# EAGLE design regboard_2 (EAGLE 5.12)
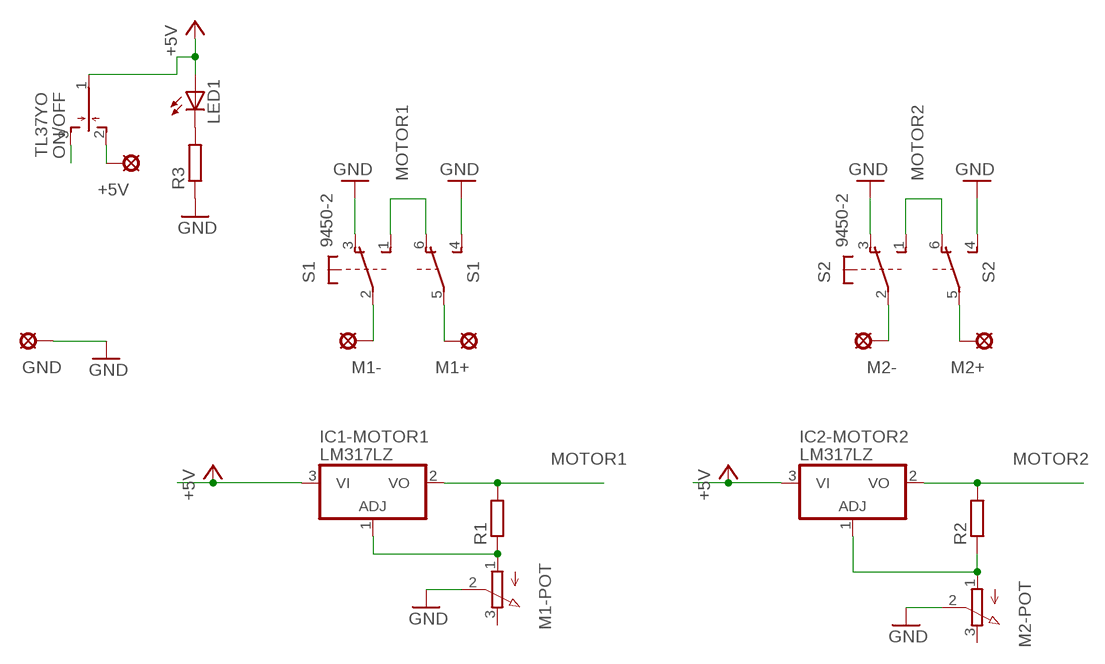
[diagram p0: schematic, sheet 1]

## Parts
+5V  SE11  [SE11]
GND  SE11  [SE11]
IC1-MOTOR1  LM317LZ  [TO92]
IC2-MOTOR2  LM317LZ  [TO92]
LED1  LED5MM  [LED5MM]
M1+  SE11  [SE11]
M1-  SE11  [SE11]
M1-POT  3RP/1610N  [3RP/1610N]
M2+  SE11  [SE11]
M2-  SE11  [SE11]
M2-POT  3RP/1610N  [3RP/1610N]
ON/OFF  TL37YO  [TL3XYO]
R1  R-EU_0207/12  [0207/12]
R2  R-EU_0207/12  [0207/12]
R3  R-EU_0207/12  [0207/12]
S1  9450-2  [9450-2]
S2  9450-2  [9450-2]

## Nets
+5V: IC1-MOTOR1.3(VI) IC2-MOTOR2.3(VI) LED1.A ON/OFF.1(C)
GND: GND.MP M1-POT.2(S) M2-POT.2(S) R3.1 S1.3(1:O) S1.4(2:S) S2.3(1:O) S2.4(2:S)
MOTOR1: IC1-MOTOR1.2(VO) R1.2 S1.1(1:S) S1.6(2:O)
MOTOR2: IC2-MOTOR2.2(VO) R2.2 S2.1(1:S) S2.6(2:O)
N$1: LED1.K(C) R3.2
N$4: ON/OFF.3(O2)
N$7: IC1-MOTOR1.1(ADJ) M1-POT.1(A) R1.1
N$8: IC2-MOTOR2.1(ADJ) M2-POT.1(A) R2.1
N$18: M2-.MP S2.2(1:P)
N$19: M2+.MP S2.5(2:P)
N$22: M1-.MP S1.2(1:P)
N$23: M1+.MP S1.5(2:P)
POWERIN: +5V.MP ON/OFF.2(O1)
Unconnected: M1-POT.3(E) M2-POT.3(E)

## Library data of the parts
+5V GND M1+ M1- M2+ M2- = solpad:SE11: SOLDER PAD RTM, drill 1,1mm, distributor Buerklin, 07F810
IC1-MOTOR1 IC2-MOTOR2 = matt:*317: Positive VOLTAGE REGULATOR
LED1 = matt led:LED: LED OSRAM: - CHIPLED LG R971, LG N971, LY N971, LG Q971, LY Q971, LO R971, LY R971 LH N974, LH R974 LS Q976, LO Q976, LY Q976 LO Q996 - Hyper CHIPLED LW Q18S LB Q993, LB Q99A, LB R99A - SideLED LS A670, LO A670, LY A670, LG A670, LP A670 LB A673, LV A673, LT A673, LW A673 LH A674 LY A675 LS A676, LA A676, LO A676, LY A676, LW A676 LS A679, LY A679, LG A679 - Hyper Micro SIDELED® LS Y876, LA Y876, LO Y876, LY Y876 LT Y87S - SmartLED LW L88C, LW L88S LB L89C, LB L89S, LG L890 LS L89K, LO L89K, LY L89K LS L896, LA L896, LO L896, LY L896 - TOPLED LS T670, LO T670, LY T670, LG T670, LP T670 LSG T670, LSP T670, LSY T670, LOP T670, LYG T670 LG T671, LOG T671, LSG T671 LB T673, LV T673, LT T673, LW T673 LH T674 LS T676, LA T676, LO T676, LY T676, LB T676, LH T676, LSB T676, LW T676 LB T67C, LV T67C, LT T67C, LS T67K, LO T67K, LY T67K, LW E67C LS E67B, LA E67B, LO E67B, LY E67B, LB E67C, LV E67C, LT E67C LW T67C LS T679, LY T679, LG T679 LS T770, LO T770, LY T770, LG T770, LP T770 LB T773, LV T773, LT T773, LW T773 LH T774 LS E675, LA E675, LY E675, LS T675 LS T776, LA T776, LO T776, LY T776, LB T776 LHGB T686 LT T68C, LB T68C - Hyper Mini TOPLED® LB M676 - Mini TOPLED Santana® LG M470 LS M47K, LO M47K, LY M47K Source: http://www.osram.convergy.de LUXEON: - LUMILED® LXK2-PW12-R00, LXK2-PW12-S00, LXK2-PW14-U00, LXK2-PW14-V00 LXK2-PM12-R00, LXK2-PM12-S00, LXK2-PM14-U00 LXK2-PE12-Q00, LXK2-PE12-R00, LXK2-PE12-S00, LXK2-PE14-T00, LXK2-PE14-U00 LXK2-PB12-K00, LXK2-PB12-L00, LXK2-PB12-M00, LXK2-PB14-N00, LXK2-PB14-P00, LXK2-PB14-Q00 LXK2-PR12-L00, LXK2-PR12-M00, LXK2-PR14-Q00, LXK2-PR14-R00 LXK2-PD12-Q00, LXK2-PD12-R00, LXK2-PD12-S00 LXK2-PH12-R00, LXK2-PH12-S00 LXK2-PL12-P00, LXK2-PL12-Q00, LXK2-PL12-R00 Source: www.luxeon.com KINGBRIGHT: KA-3528ASYC Source: www.kingbright.com
M1-POT M2-POT = pot:3RP/1610N: 16mm Potentiometer one level Source: http://www.alphapotentiometers.net/html/16mm_pot_2.html
ON/OFF = matt:TL37YO: TINY SWITCH MOM OFF MOM Source: http://www2.produktinfo.conrad.com/datenblaetter/700000-724999/705152-da-01-de-Subminiaturschalter_TL_36YO.pdf
R1-R3 = matt rcl:R-EU_: RESISTOR, European symbol
S1 S2 = switch-misc:9450-2: MARQUARDT SWITCH

## Net classes
0 default: width 0.4 mm

## Board
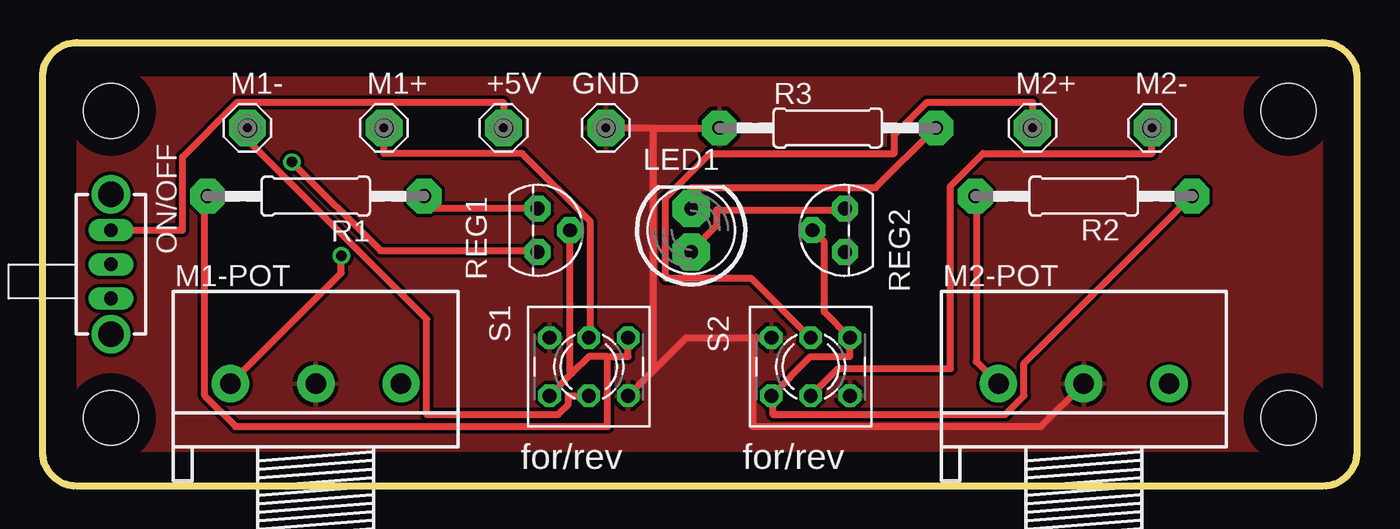
[diagram p1: board, top side]
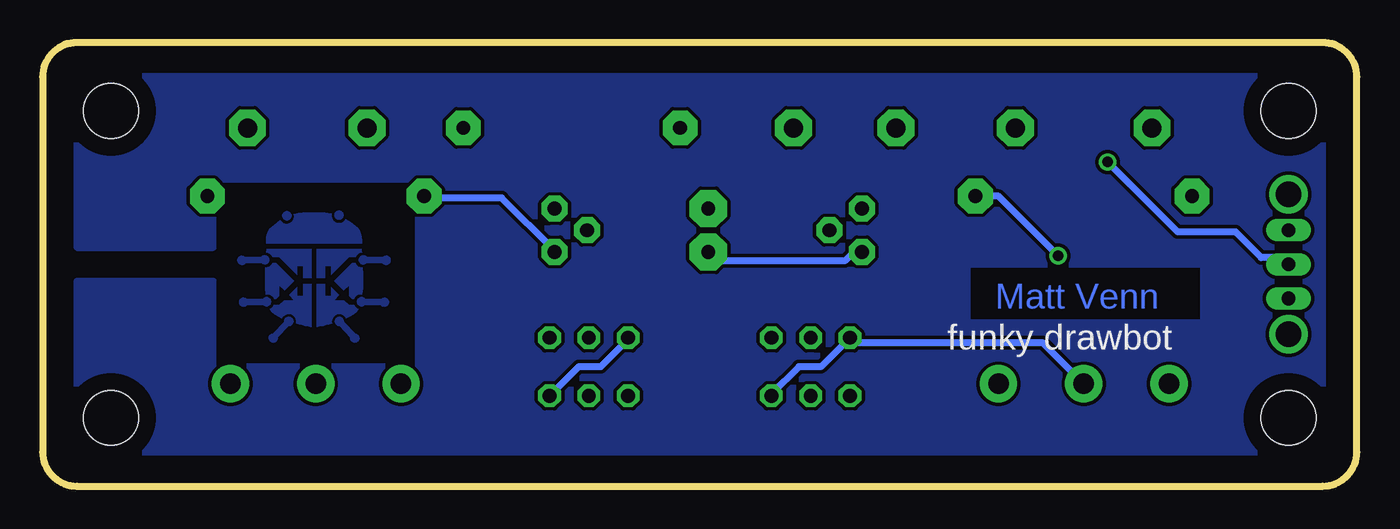
[diagram p2: board, bottom side, seen from below]

Size 77 x 26 mm. Coordinates in mm from the lower left corner, seen from the top.
Outline: 77,2 arc-90 75,0 2,0 arc-90 0,2 0,24 arc-90 2,26 75,26 arc-90 77,24 77,2
Copper layers (1*16): Top 0.035mm / dielectric 1.5mm / Bottom 0.035mm
Design rules "default": minimum track width 10mil, minimum drill 24mil, track to track 8mil, track to pad 8mil, pad to pad 8mil, via to via 8mil, smd to smd 8mil, copper to edge 40mil, drill to drill 8mil, minimum pad ring 10mil, minimum via ring 8mil, stop-mask expansion 4mil, vias tented up to drill 0mil, thermal gap 10mil
Holes 3.2 mm at 4,4 4,22 73,22 73,4
bRestrict: area 9.2,9.8 to 22.6,12.8

### Footprints (pad centres in the part's own frame; a part is rotated, then mirrored left to right if it is on the bottom)
SE11 = drill 1.118 pad 2.159 octagon: MP 0,0
TO92 = drill 0.813 pad 1.524 octagon: 1 -1.27,0; 2 0,1.905; 3 1.27,0
LED5MM = drill 0.813 pad 2.184 octagon: A -1.27,0; K 1.27,0
3RP/1610N = drill 1.2 pad 2.184 round: 1 -5,0; 2 0,0; 3 5,0
TL3XYO = drill 0.8 long: 1 0,0; 2 -2,0; 3 2,0 | drill 1.5 round: P$4 4.1,0; P$5 -4.1,0
0207/12 = drill 0.813 pad 2.032 octagon: 1 -6.35,0; 2 6.35,0
9450-2 = drill 0.813 octagon: 1 -2.3,-1.7; 2 0,-1.7; 3 2.3,-1.7; 4 -2.3,1.7; 5 0,1.7; 6 2.3,1.7

### Placement (x,y rotation side)
+5V  27,21 0 top
GND  33,21 0 top
IC1-MOTOR1  29,15 270 top
IC2-MOTOR2  47,15 90 top
LED1  38,15 90 top
M1+  20,21 0 top
M1-  12,21 0 top
M1-POT  16,6 0 top
M2+  58,21 0 top
M2-  65,21 0 top
M2-POT  61,6 0 top
ON/OFF  4,13 270 top
R1  16,17 180 top
R2  61,17 0 top
R3  46,21 0 top
S1  32,7 0 top
S2  45,7 0 top

### Tracks (layer width: path | path; a pad name or v marks a point on that pad's centre or on a via)
+5V  (via drill 0.61)
  Top 0.4: IC2-MOTOR2.3 47,16.2 39.5,16.2 39.5,15.3 38,13.8 LED1.A | v14.6,19 19.8,13.8 29,13.8 IC1-MOTOR1.3
  Bottom 0.4: ON/OFF.1 4.4,13.4 5.6,13.4 7.1,14.9 10.5,14.9 v14.6,19 | LED1.A 38,13.7 37.5,13.2 30,13.2 29.5,13.7 29,13.7 IC1-MOTOR1.3
GND
  Top 0.4: 35.8,21 GND.MP | 35.8,21 R3.1 | 35.9,6.9 37.7,8.7 41.6,8.7 | S1.3 35.9,6.9 | 41.6,8.7 S2.4 | M2-POT.2 58.5,3.5 41.6,3.5 41.6,8.7 | 35.8,21 35.8,7 35.9,6.9
  Bottom 0.4: S1.3 34.3,5.4 32.7,7 31.4,7 S1.4 29.8,8.4 18.4,8.4 M1-POT.2 | S2.3 45.6,7 44.3,7 42.7,8.6 S2.4
  pour Top: 2,24 75,24 75,2 2,2
MOTOR1
  Top 0.4: 31,6.6 32,7.6 33.1,7.6 | 31,6.6 S1.1 | 33.1,7.6 34.3,7.6 S1.6 | IC1-MOTOR1.2 30.9,6.7 31,6.6 | R1.2 9.6,17 9.5,16.9 9.5,5.3 11.3,3.5 33.1,3.5 33.1,7.6
MOTOR2
  Top 0.4: IC2-MOTOR2.2 45.8,14.3 45.8,10.2 S2.6 47.3,7.6 45,7.6 S2.1 42.8,5.2 42.8,4.2 56.4,4.2 57.5,5.3 57.5,7.2 67.3,17 R2.2
N$1
  Top 0.4: R3.2 52.3,21 48.8,17.5 38,17.5 LED1.K
N$2
  pour Bottom: 2,24 75,24 75,14 67,14 67,18 55,18 55,7 67,7 67,12 75,12 75,2 2,2
N$3
  pour Bottom: 62.59,9.93 62.48,9.92 62.39,9.86 62.33,9.77 62.31,9.67 62.32,9.56 62.38,9.47 62.48,9.4 62.59,9.39 63.22,8.73 63.22,8.66 63.23,8.6 63.25,8.54 63.29,8.48 63.38,8.42 63.48,8.4 63.59,8.42 63.68,8.48 63.74,8.56 63.76,8.67 63.75,8.77 63.69,8.86 63.6,8.92 63.5,8.95 62.85,9.62 62.84,9.74 62.78,9.85 62.69,9.91
N$5
  pour Bottom: 63.88,11.09 63.83,11.08 63.77,11.06 63.73,11.04 63.69,11.01 63.65,10.97 63.63,10.92 63.61,10.87 63.61,10.81 63.61,10.76 63.63,10.71 63.65,10.66 63.69,10.62 63.73,10.59 63.77,10.56 63.83,10.54 63.88,10.54 63.94,10.55 64,10.56 64.04,10.59 64.09,10.63 65,10.63 65.04,10.58 65.09,10.55 65.15,10.52 65.22,10.51 65.28,10.52 65.33,10.54 65.37,10.56 65.42,10.6 65.45,10.64 65.47,10.68 65.49,10.73 65.5,10.79 65.49,10.84 65.47,10.9 65.45,10.94 65.42,10.98 65.37,11.02 65.33,11.04 65.28,11.06 65.22,11.06 65.12,11.04 65.03,10.98 64.1,10.98 64.05,11.03 64,11.06 63.94,11.08
N$6
  pour Bottom: 63.88,13.9 63.89,13.89 63.89,13.85 63.9,13.78 63.9,13.69 63.78,13.67 63.68,13.61 63.59,13.53 63.53,13.43 63.15,13.43 62.09,12.38 62.09,12.9 61.74,12.9 61.74,12.2 61.25,12.2 61.25,13.9
N$7  (via drill 0.61)
  Top 0.4: IC1-MOTOR1.1 29,16.3 22.4,16.3 22.4,17 R1.1 | M1-POT.1 17.5,12.5 v17.5,13.5
  Bottom 0.4: v17.5,13.5 21,17 R1.1
N$8
  Top 0.4: M2-POT.1 54.7,7.3 54.7,17 R2.1
  Bottom 0.4: IC2-MOTOR2.1 47,13.8 50.1,16.9 54.5,16.9 54.6,17 R2.1
N$9
  pour Bottom: 63.53,13.08 63.6,12.97 63.69,12.89 63.81,12.83 63.94,12.81 63.96,12.81 63.97,12.43 63.97,12.03 63.96,11.62 63.93,11.24 63.85,11.25 63.72,11.23 63.6,11.17 63.51,11.08 63.44,10.97 63.32,10.97 63.15,11.14 63.15,11.78 62.83,11.46 62.27,12.02 63.32,13.08
N$10
  pour Bottom: 61.74,11.85 61.74,11.14 62.09,11.14 62.09,11.67 62.57,11.2 62.27,10.9 62.86,10.9 63.15,10.62 63.45,10.62 63.5,10.54 63.56,10.48 63.63,10.43 63.71,10.39 63.71,10.39 63.58,10.22 63.41,10.07 63.21,9.94 62.99,9.82 62.92,9.93 62.83,10.01 62.72,10.07 62.59,10.09 62.41,10.05 62.27,9.96 62.18,9.82 62.15,9.65 62.16,9.53 61.98,9.48 61.81,9.44 61.65,9.41 61.52,9.38 61.41,9.36 61.32,9.34 61.27,9.34 61.25,9.33 61.25,11.85
N$11
  pour Bottom: 63.99,13.54 63.93,13.53 63.88,13.52 63.83,13.49 63.79,13.46 63.76,13.42 63.73,13.37 63.72,13.32 63.71,13.26 63.72,13.21 63.73,13.16 63.76,13.11 63.79,13.07 63.83,13.04 63.88,13.01 63.93,13 63.99,12.99 64.1,13.02 64.19,13.08 65.1,13.08 65.14,13.03 65.2,13 65.26,12.97 65.33,12.97 65.38,12.97 65.43,12.99 65.48,13.01 65.52,13.05 65.55,13.09 65.58,13.13 65.59,13.18 65.6,13.24 65.59,13.29 65.58,13.35 65.55,13.39 65.52,13.43 65.48,13.47 65.43,13.49 65.38,13.51 65.33,13.51 65.22,13.49 65.13,13.43 64.2,13.43 64.16,13.48 64.11,13.51 64.05,13.53
N$12
  pour Bottom: 59.61,9.93 59.51,9.91 59.42,9.85 59.36,9.74 59.35,9.62 58.7,8.95 58.6,8.92 58.51,8.86 58.45,8.77 58.44,8.67 58.46,8.56 58.52,8.48 58.61,8.42 58.72,8.4 58.82,8.42 58.91,8.48 58.95,8.54 58.97,8.6 58.98,8.66 58.98,8.73 59.61,9.39 59.72,9.4 59.82,9.47 59.88,9.56 59.89,9.67 59.87,9.77 59.81,9.86 59.72,9.92
N$13
  pour Bottom: 58.32,11.09 58.26,11.08 58.2,11.06 58.15,11.03 58.1,10.98 57.17,10.98 57.08,11.04 56.98,11.06 56.92,11.06 56.87,11.04 56.83,11.02 56.78,10.98 56.75,10.94 56.73,10.9 56.71,10.84 56.7,10.79 56.71,10.73 56.73,10.68 56.75,10.64 56.78,10.6 56.83,10.56 56.87,10.54 56.92,10.52 56.98,10.51 57.05,10.52 57.11,10.55 57.16,10.58 57.2,10.63 58.11,10.63 58.16,10.59 58.2,10.56 58.26,10.55 58.32,10.54 58.37,10.54 58.43,10.56 58.47,10.59 58.51,10.62 58.55,10.66 58.57,10.71 58.59,10.76 58.59,10.81 58.59,10.87 58.57,10.92 58.55,10.97 58.51,11.01 58.47,11.04 58.43,11.06 58.37,11.08
N$14
  pour Bottom: 58.32,13.9 58.31,13.89 58.31,13.85 58.3,13.78 58.3,13.69 58.42,13.67 58.52,13.61 58.61,13.53 58.67,13.43 59.05,13.43 60.11,12.38 60.11,12.9 60.46,12.9 60.46,12.2 60.95,12.2 60.95,13.9
N$15
  pour Bottom: 58.67,13.08 58.6,12.97 58.51,12.89 58.39,12.83 58.26,12.81 58.24,12.81 58.23,12.43 58.23,12.03 58.24,11.62 58.27,11.24 58.35,11.25 58.48,11.23 58.6,11.17 58.69,11.08 58.76,10.97 58.88,10.97 59.05,11.14 59.05,11.78 59.37,11.46 59.93,12.02 58.88,13.08
N$16
  pour Bottom: 60.46,11.85 60.46,11.14 60.11,11.14 60.11,11.67 59.63,11.2 59.93,10.9 59.34,10.9 59.05,10.62 58.75,10.62 58.7,10.54 58.64,10.48 58.57,10.43 58.49,10.39 58.49,10.39 58.62,10.22 58.79,10.07 58.99,9.94 59.21,9.82 59.28,9.93 59.37,10.01 59.48,10.07 59.61,10.09 59.79,10.05 59.93,9.96 60.02,9.82 60.05,9.65 60.04,9.53 60.22,9.48 60.39,9.44 60.55,9.41 60.68,9.38 60.79,9.36 60.88,9.34 60.93,9.34 60.95,9.33 60.95,11.85
N$17
  pour Bottom: 58.21,13.54 58.15,13.53 58.09,13.51 58.04,13.48 58,13.43 57.07,13.43 56.98,13.49 56.87,13.51 56.82,13.51 56.77,13.49 56.72,13.47 56.68,13.43 56.65,13.39 56.62,13.35 56.61,13.29 56.6,13.24 56.61,13.18 56.62,13.13 56.65,13.09 56.68,13.05 56.72,13.01 56.77,12.99 56.82,12.97 56.87,12.97 56.94,12.97 57,13 57.06,13.03 57.1,13.08 58.01,13.08 58.05,13.04 58.1,13.02 58.15,13 58.21,12.99 58.27,13 58.32,13.01 58.37,13.04 58.41,13.07 58.44,13.11 58.47,13.16 58.48,13.21 58.49,13.26 58.48,13.32 58.47,13.37 58.44,13.42 58.41,13.46 58.37,13.49 58.32,13.52 58.27,13.53
N$18
  Top 0.4: S2.2 46.6,6.9 53.2,6.9 53.2,17.6 55.1,19.5 65,19.5 M2-.MP
N$19
  Top 0.4: S2.5 41.5,12.2 36.5,12.2 36.5,16.9 39.1,19.5 49.9,19.5 49.9,20.6 51.8,22.5 58,22.5 M2+.MP
N$20
  pour Bottom: 62.97,15.85 62.96,15.8 62.95,15.75 62.92,15.7 62.89,15.66 62.85,15.63 62.8,15.6 62.75,15.59 62.69,15.58 62.64,15.59 62.59,15.6 62.54,15.63 62.5,15.66 62.47,15.7 62.44,15.75 62.42,15.8 62.42,15.85 62.42,15.91 62.44,15.96 62.47,16.01 62.5,16.05 62.54,16.08 62.59,16.11 62.64,16.12 62.69,16.13 62.75,16.12 62.8,16.11 62.85,16.08 62.89,16.05 62.92,16.01 62.95,15.96 62.96,15.91
N$21
  pour Bottom: 59.91,15.89 59.9,15.83 59.89,15.78 59.86,15.74 59.83,15.7 59.79,15.66 59.74,15.64 59.69,15.62 59.63,15.61 59.58,15.62 59.53,15.64 59.48,15.66 59.44,15.7 59.41,15.74 59.38,15.78 59.37,15.83 59.36,15.89 59.37,15.94 59.38,16 59.41,16.04 59.44,16.08 59.48,16.12 59.53,16.14 59.58,16.16 59.63,16.16 59.69,16.16 59.74,16.14 59.79,16.12 59.83,16.08 59.86,16.04 59.89,16 59.9,15.94
N$22
  Top 0.4: S1.2 30.8,5.3 30.8,4.8 30.2,4.2 22.5,4.2 22.5,9.8 12,20.3 M1-.MP
N$23
  Top 0.4: S1.5 32.1,8.8 32.1,15.5 28.1,19.5 20,19.5 M1+.MP
N$24
  pour Bottom: 60.44,16.03 60.06,15.99 60.08,15.85 60.05,15.68 59.95,15.54 59.81,15.45 59.64,15.41 59.52,15.43 59.4,15.48 59.31,15.56 59.25,15.67 59.04,15.53 58.85,15.41 58.69,15.28 58.55,15.15 58.44,15.01 58.36,14.83 58.31,14.62 58.29,14.37 58.29,14.26 58.29,14.21 63.92,14.21 63.92,14.26 63.92,14.37 63.9,14.61 63.86,14.8 63.78,14.96 63.69,15.09 63.57,15.21 63.42,15.33 63.26,15.45 63.07,15.59 63,15.5 62.92,15.44 62.81,15.39 62.7,15.38 62.53,15.41 62.39,15.51 62.3,15.65 62.26,15.82 62.29,15.96 62.03,16.01 61.77,16.03
POWERIN
  Top 0.4: ON/OFF.2 8.2,15 8.2,19.3 11.4,22.5 27,22.5 +5V.MP

### Text on the board
Bottom: Matt Venn
tNames: REG1 | REG2 | for/rev | for/rev
bNames: funky drawbot